# EAGLE design MRCS-Relay-Latch (EAGLE 7.7.0)
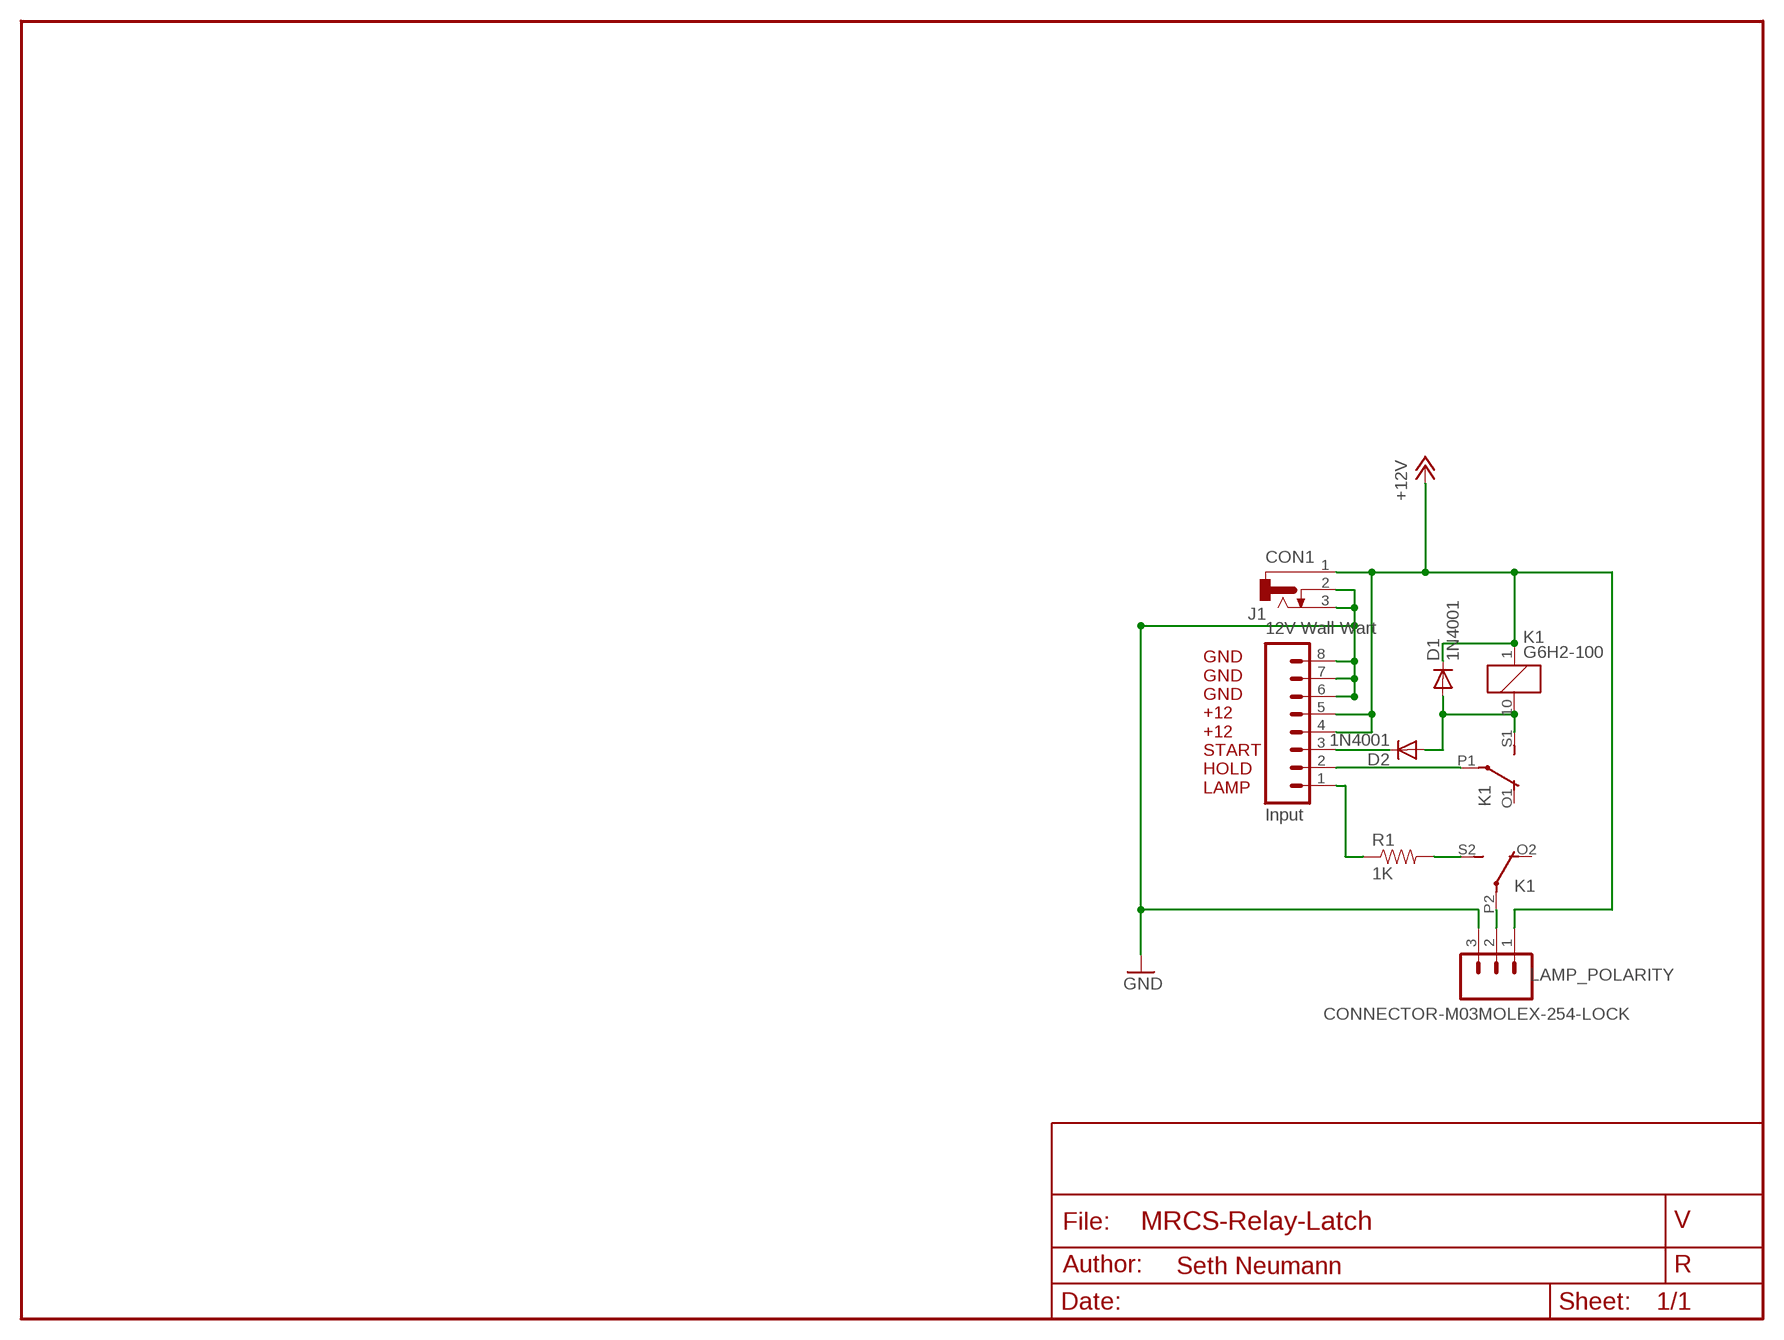
[diagram p0: schematic, sheet 1]

## Parts
CON1  12V Wall Wart  CONNECTOR-DC-POWER-RA  [DCJ0202]
D1  1N4001  DIODEPTH  [DIODE-1N4001]
D2  1N4001  DIODEPTH  [DIODE-1N4001]
J1  Input  CONNECTOR-M08FEMALE_LOCK  [1X08_FEMALE_LOCK]
K1  G6H2-100  [G6H2-100]
LAMP_POLARITY  CONNECTOR-M03MOLEX-254-LOCK  [MOLEX-1X3_LOCK]
R1  1K  RPTH04  [AXIAL-0.4-RES]

## Nets
+12V [Power]: CON1.1 D1.C J1.4 J1.5 K1.1 LAMP_POLARITY.1
GND [Power]: CON1.2 CON1.3 J1.6 J1.7 J1.8 LAMP_POLARITY.3
HOLD [Power]: J1.2 K1.P1(2:P)
LAMP [Power]: J1.1 R1.P$1
N$1 [Power]: K1.P2(3:P) LAMP_POLARITY.2
N$2 [Power]: K1.S2(3:S) R1.P$2
N$3 [Power]: D1.A D2.A K1.10 K1.S1(2:S)
START [Power]: D2.C J1.3
Unconnected: K1.O1(2:O) K1.O2(3:O)

## Notes on the sheet
- GND
  GND
  GND
  +12
  +12
  START
  HOLD
  LAMP
- Seth Neumann

## Library data of the parts
CON1 = SPCoast:CONNECTOR-DC-POWER: DC POWER JACK
D1 D2 = SPCoast:DIODE: Diode These are standard reverse protection diodes and small signal diodes. SMA package can handle up to about 1A. SOD-323 can handle about 200mA. What the SOD-323 package when ordering, there are some mfgs out there that are 5-pin packages.
J1 = SPCoast:CONNECTOR-M08: Header 8 Standard 8-pin 0.1" header. Use with straight break away headers (SKU : PRT-00116), right angle break away headers (PRT-00553), swiss pins (PRT-00743), machine pins (PRT-00117), and female headers (PRT-00115).
K1 = relay:G6H2-100: RELAY 2 x switch, 0.5 A/125 V AC, 1 A/30 V DC, Omron; OC_FARNELL: unknown; OC_NEWARK: unknown
LAMP_POLARITY = SPCoast:CONNECTOR-M03
R1 = SPCoast:R*: Resistor Basic schematic elements and footprints for 0603, 1206, and PTH 1/10th watt (small) resistors.

## Net classes
0 default: width 0.254 mm, clearance 0.254 mm
1 Power: width 0.406 mm, clearance 0.254 mm
2 Phone: width 0.305 mm, clearance 0.381 mm
3 Nasty Loads: width 0.61 mm, clearance 0.61 mm

## Board
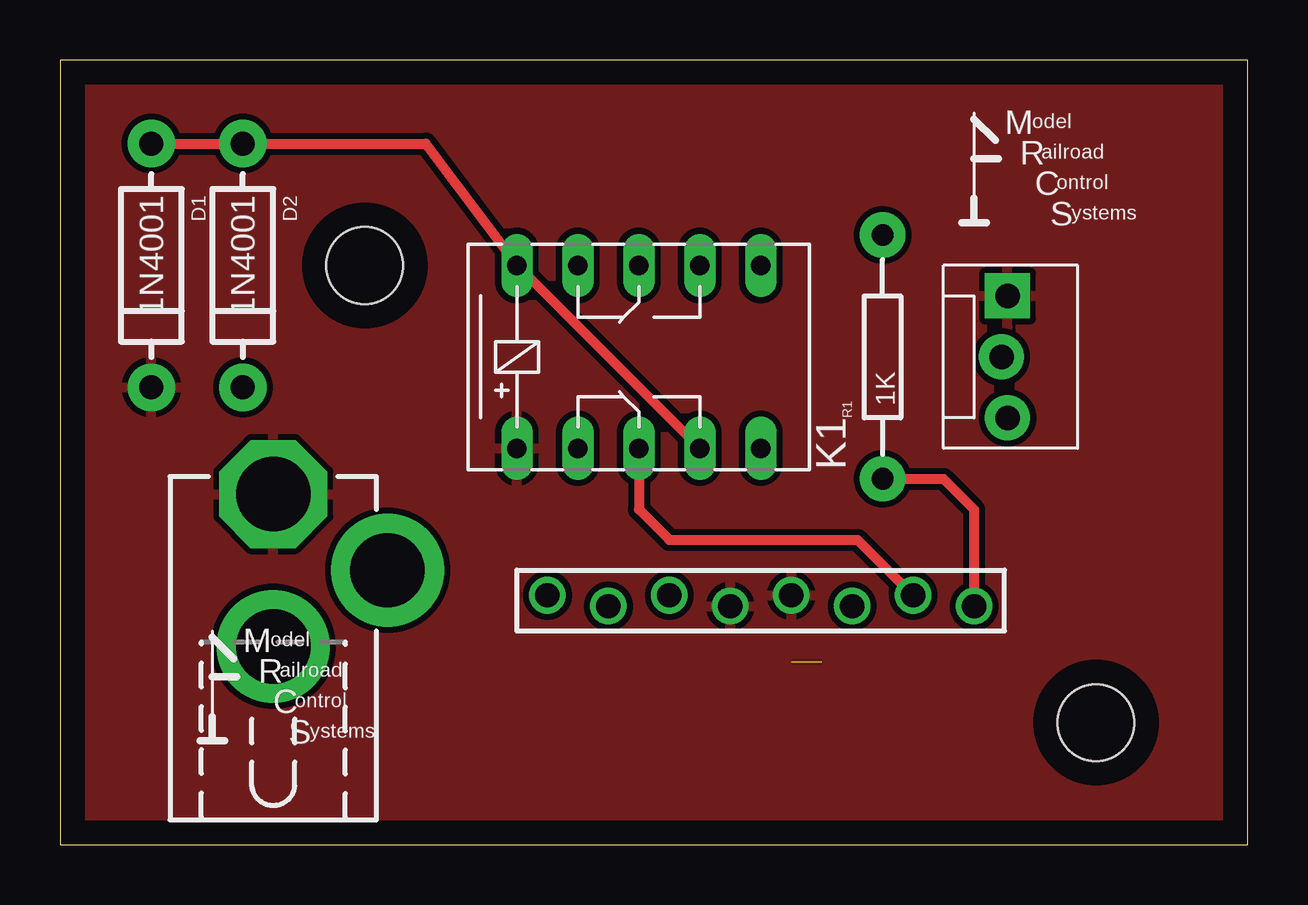
[diagram p1: board, top side]
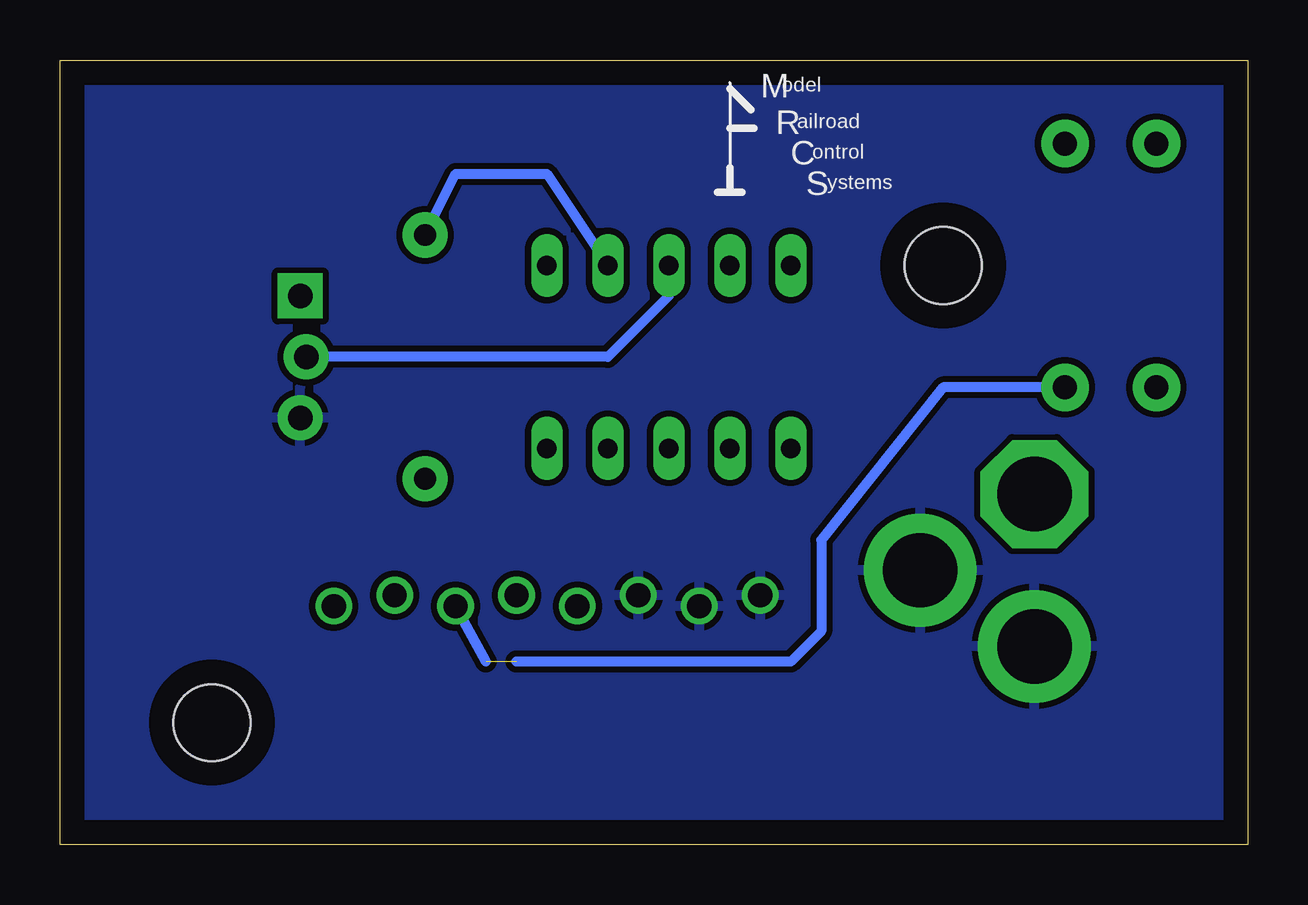
[diagram p2: board, bottom side, seen from below]

Size 49.51 x 32.69 mm. Coordinates in mm from the lower left corner, seen from the top.
Outline: 0,0 49.51,0 49.51,32.69 0,32.69 0,0
Copper layers (1*16): Top 0.035mm / dielectric 1.5mm / Bottom 0.035mm
Design rules "default": minimum track width 10mil, minimum drill 24mil, track to track 8mil, track to pad 8mil, pad to pad 8mil, via to via 8mil, smd to smd 8mil, copper to edge 40mil, drill to drill 8mil, minimum pad ring 10mil, minimum via ring 8mil, stop-mask expansion 4mil, vias tented up to drill 0mil, thermal gap 10mil
Holes 3.2 mm at 12.7,24.13 43.18,5.08

### Footprints (pad centres in the part's own frame; a part is rotated, then mirrored left to right if it is on the bottom)
DCJ0202 = drill 3.1 pad 4.5 octagon: 1 0,3.175 | drill 3.1 pad 4.7: 2 4.763,0; 3 0,-3.175
DIODE-1N4001 = drill 1 pad 1.981: A 5.08,0; C -5.08,0
1X08_FEMALE_LOCK = drill 1.016: 1 0,0.229; 2 2.54,-0.229; 3 5.08,0.229; 4 7.62,-0.229; 5 10.16,0.229; 6 12.7,-0.229; 7 15.24,0.229; 8 17.78,-0.229
G6H2-100 = drill 0.813 long: 1 -5.08,-3.81; 5 5.08,-3.81; 6 5.08,3.81; 10 -5.08,3.81; O1 -2.54,-3.81; O2 -2.54,3.81; P1 0,-3.81; P2 0,3.81; S1 2.54,-3.81; S2 2.54,3.81
MOLEX-1X3_LOCK = drill 1.016 pad 1.88 square: 1 0,0.127 | drill 1.016 pad 1.88: 2 2.54,-0.127; 3 5.08,0.127
AXIAL-0.4-RES = drill 0.9 pad 1.88: P$1 -5.08,0; P$2 5.08,0

### Placement (x,y rotation side)
CON1  8.89,11.43 0 top
D1  3.81,24.13 90 top
D2  7.62,24.13 90 top
J1  38.1,10.16 180 top
K1  24.13,20.32 0 top
LAMP_POLARITY  39.37,22.86 270 top
R1  34.29,20.32 90 top
U$1  [MRCSLOGOBTM]  15.24,26.67 0 top
U$2  [MRCSLOGOTOP]  5.08,3.81 0 top
U$3  [MRCSLOGOTOP]  36.83,25.4 0 top
U$4  [CA-PROP65WARNING]  29.21,20.32 0 top

### Tracks (layer width: path | path; a pad name or v marks a point on that pad's centre or on a via)
+12V
  pour Top: 0,0 49.53,0 49.53,33.02 0,33.02
GND
  pour Bottom: 0,0 49.53,0 49.53,33.02 0,33.02
HOLD
  Top 0.406: K1.P1 24.13,13.97 25.4,12.7 33.25,12.7 J1.2
LAMP
  Top 0.406: R1.P$1 36.83,15.24 38.1,13.97 J1.1
N$1
  Bottom 0.406: K1.P2 24.13,22.86 26.67,20.32 LAMP_POLARITY.2
N$2
  Bottom 0.406: R1.P$2 33.02,27.94 29.21,27.94 K1.S2
N$3
  Top 0.406: D1.A D2.A 15.24,29.21 K1.10 K1.S1
START  (1 unrouted)
  Bottom 0.406: D2.C 12.7,19.05 17.78,12.7 17.78,8.89 19.05,7.62 30.48,7.62 | 31.75,7.62 J1.3

### Text on the board
tDocu: +12 / LAMP / GND | Gnd / Gnd / Gnd / +12 / +12 / Start / Hold(A) / Lamp
bDocu: Relay Latch / Seth Neumann / July 1, 2020 | Gnd / Gnd / Gnd / +12 / +12 / Start / Hold(A) / Lamp